# EAGLE design small_7 (EAGLE 7.7.0)
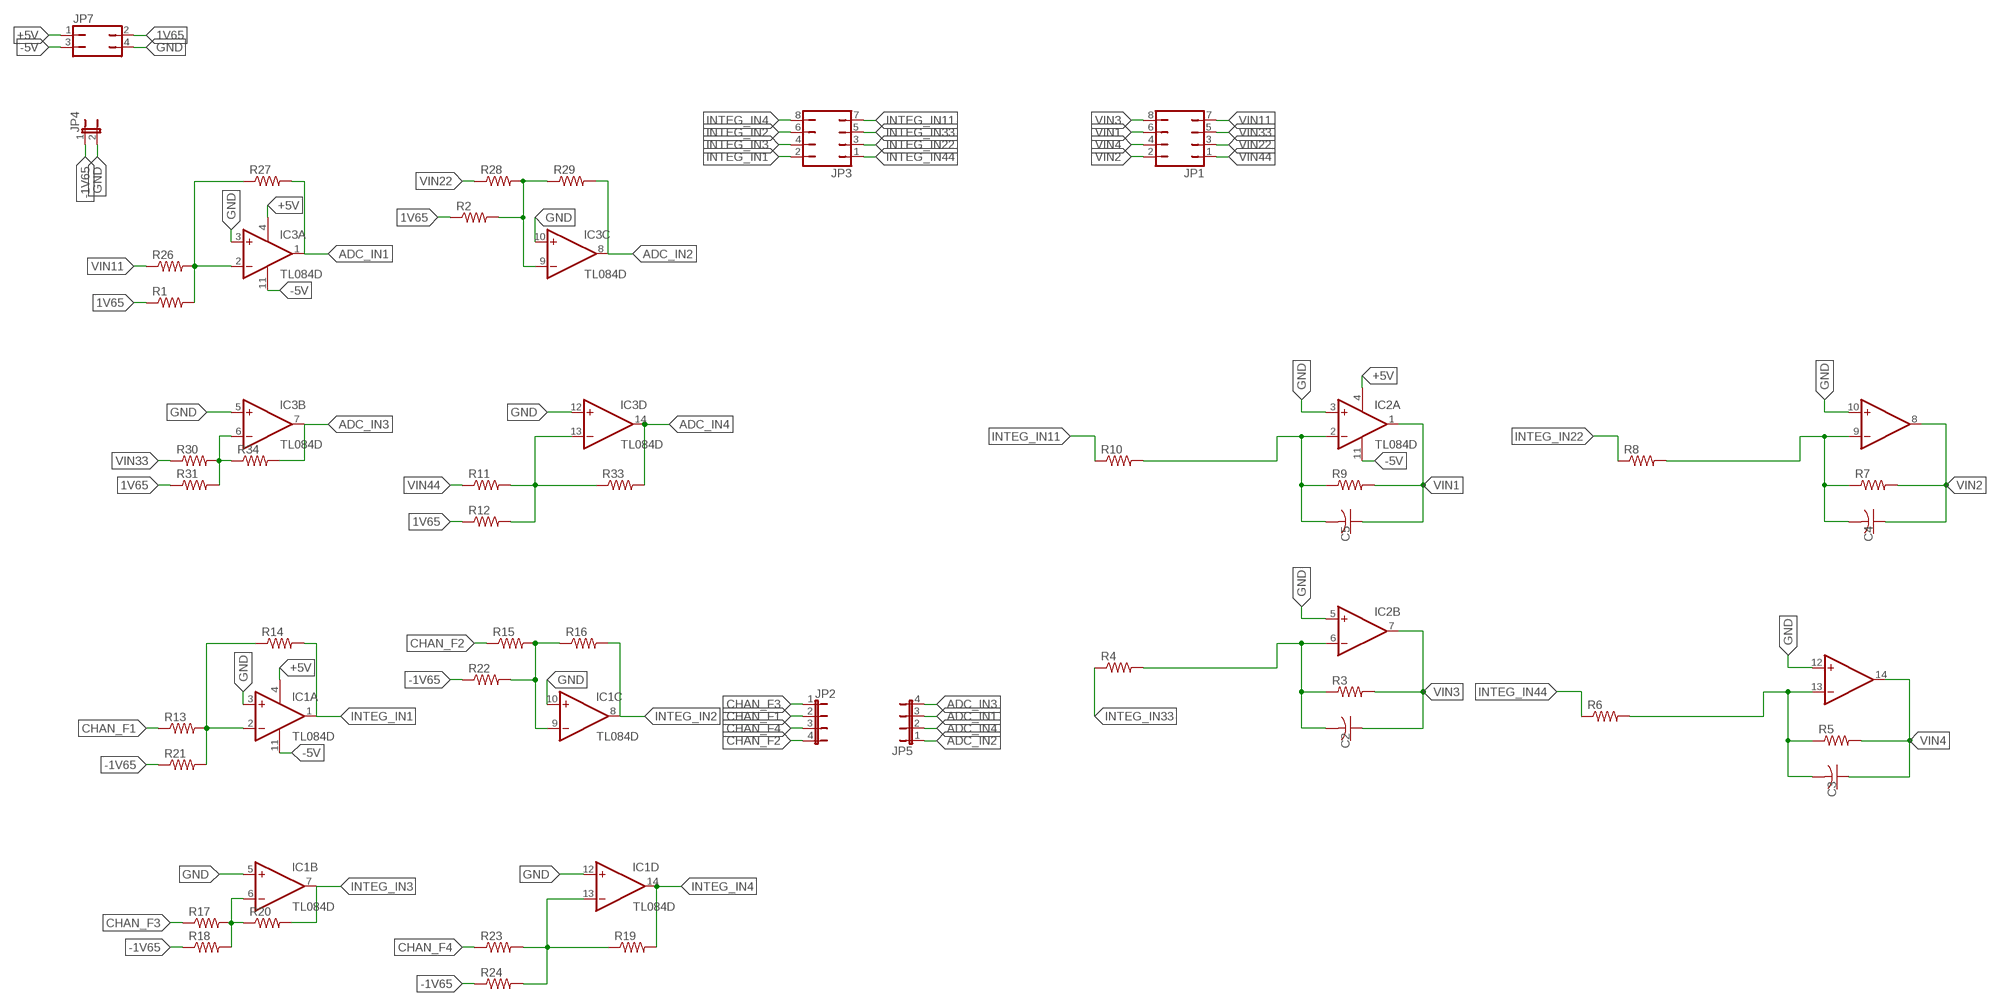
[diagram p0: schematic, sheet 1]

## Parts
C2  C-USC1206  [C1206]
C3  C-USC1206  [C1206]
C4  C-USC1206  [C1206]
C5  C-USC1206  [C1206]
IC1  TL084D  [SO14]
IC2  TL084D  [SO14]
IC3  TL084D  [SO14]
JP1  JP4Q  [JP4Q]
JP2  JP4E  [JP4]
JP3  JP4Q  [JP4Q]
JP4  JP1E  [JP1]
JP5  JP4E  [JP4]
JP7  JP2Q  [JP2Q]
R1  R-US_R1206  [R1206]
R2  R-US_R1206  [R1206]
R3  R-US_R1206  [R1206]
R4  R-US_R1206  [R1206]
R5  R-US_R1206  [R1206]
R6  R-US_R1206  [R1206]
R7  R-US_R1206  [R1206]
R8  R-US_R1206  [R1206]
R9  R-US_R1206  [R1206]
R10  R-US_R1206  [R1206]
R11  R-US_R1206  [R1206]
R12  R-US_R1206  [R1206]
R13  R-US_R1206  [R1206]
R14  R-US_R1206  [R1206]
R15  R-US_R1206  [R1206]
R16  R-US_R1206  [R1206]
R17  R-US_R1206  [R1206]
R18  R-US_R1206  [R1206]
R19  R-US_R1206  [R1206]
R20  R-US_R1206  [R1206]
R21  R-US_R1206  [R1206]
R22  R-US_R1206  [R1206]
R23  R-US_R1206  [R1206]
R24  R-US_R1206  [R1206]
R26  R-US_R1206  [R1206]
R27  R-US_R1206  [R1206]
R28  R-US_R1206  [R1206]
R29  R-US_R1206  [R1206]
R30  R-US_R1206  [R1206]
R31  R-US_R1206  [R1206]
R33  R-US_R1206  [R1206]
R34  R-US_R1206  [R1206]

## Nets
1V65: JP7.2 R1.1 R2.1 R12.1 R31.1
+5V: IC1.4(P:V+) IC2.4(P:V+) IC3.4(P:V+) JP7.1
-1V65: JP4.1 R18.1 R21.1 R22.1 R24.1
-5V: IC1.11(P:V-) IC2.11(P:V-) IC3.11(P:V-) JP7.3
ADC_IN1: IC3.1(A:OUT) JP5.3 R27.2
ADC_IN2: IC3.8(C:OUT) JP5.1 R29.2
ADC_IN3: IC3.7(B:OUT) JP5.4 R34.2
ADC_IN4: IC3.14(D:OUT) JP5.2 R33.2
CHAN_F1: JP2.2 R13.1
CHAN_F2: JP2.4 R15.1
CHAN_F3: JP2.1 R17.1
CHAN_F4: JP2.3 R23.1
GND [power]: IC1.3(A:+IN) IC1.5(B:+IN) IC1.10(C:+IN) IC1.12(D:+IN) IC2.3(A:+IN) IC2.5(B:+IN) IC2.10(C:+IN) IC2.12(D:+IN) IC3.3(A:+IN) IC3.5(B:+IN) IC3.10(C:+IN) IC3.12(D:+IN) JP4.2 JP7.4
INTEG_IN1: IC1.1(A:OUT) JP3.2 R14.2
INTEG_IN2: IC1.8(C:OUT) JP3.6 R16.2
INTEG_IN3: IC1.7(B:OUT) JP3.4 R20.2
INTEG_IN4: IC1.14(D:OUT) JP3.8 R19.2
INTEG_IN11: JP3.7 R10.1
INTEG_IN22: JP3.3 R8.1
INTEG_IN33: JP3.5 R4.1
INTEG_IN44: JP3.1 R6.1
N$1: IC1.2(A:-IN) R13.2 R14.1 R21.2
N$3: IC1.9(C:-IN) R15.2 R16.1 R22.2
N$4: C5.2 IC2.2(A:-IN) R9.1 R10.2
N$5: C2.2 IC2.6(B:-IN) R3.1 R4.2
N$6: IC1.13(D:-IN) R19.1 R23.2 R24.2
N$7: IC1.6(B:-IN) R17.2 R18.2 R20.1
N$8: C3.2 IC2.13(D:-IN) R5.1 R6.2
N$9: C4.2 IC2.9(C:-IN) R7.1 R8.2
N$36: IC3.2(A:-IN) R1.2 R26.2 R27.1
N$38: IC3.9(C:-IN) R2.2 R28.2 R29.1
N$42: IC3.13(D:-IN) R11.2 R12.2 R33.1
N$43: IC3.6(B:-IN) R30.2 R31.2 R34.1
VIN1: C5.1 IC2.1(A:OUT) JP1.6 R9.2
VIN2: C4.1 IC2.8(C:OUT) JP1.2 R7.2
VIN3: C2.1 IC2.7(B:OUT) JP1.8 R3.2
VIN4: C3.1 IC2.14(D:OUT) JP1.4 R5.2
VIN11: JP1.7 R26.1
VIN22: JP1.3 R28.1
VIN33: JP1.5 R30.1
VIN44: JP1.1 R11.1

## Library data of the parts
C2-C5 = rcl:C-US: CAPACITOR, American symbol; SPICEPREFIX: C
IC1-IC3 = linear:TL084: OP AMP
JP1 JP3 = jumper:JP4Q: JUMPER
JP2 JP5 = jumper:JP4E: JUMPER
JP4 = jumper:JP1E: JUMPER
JP7 = jumper:JP2Q: JUMPER
R1-R24 R26-R31 R33 R34 = rcl:R-US_: RESISTOR, American symbol; SPICEPREFIX: R

## Net classes
1 power: width 0.254 mm

## Board
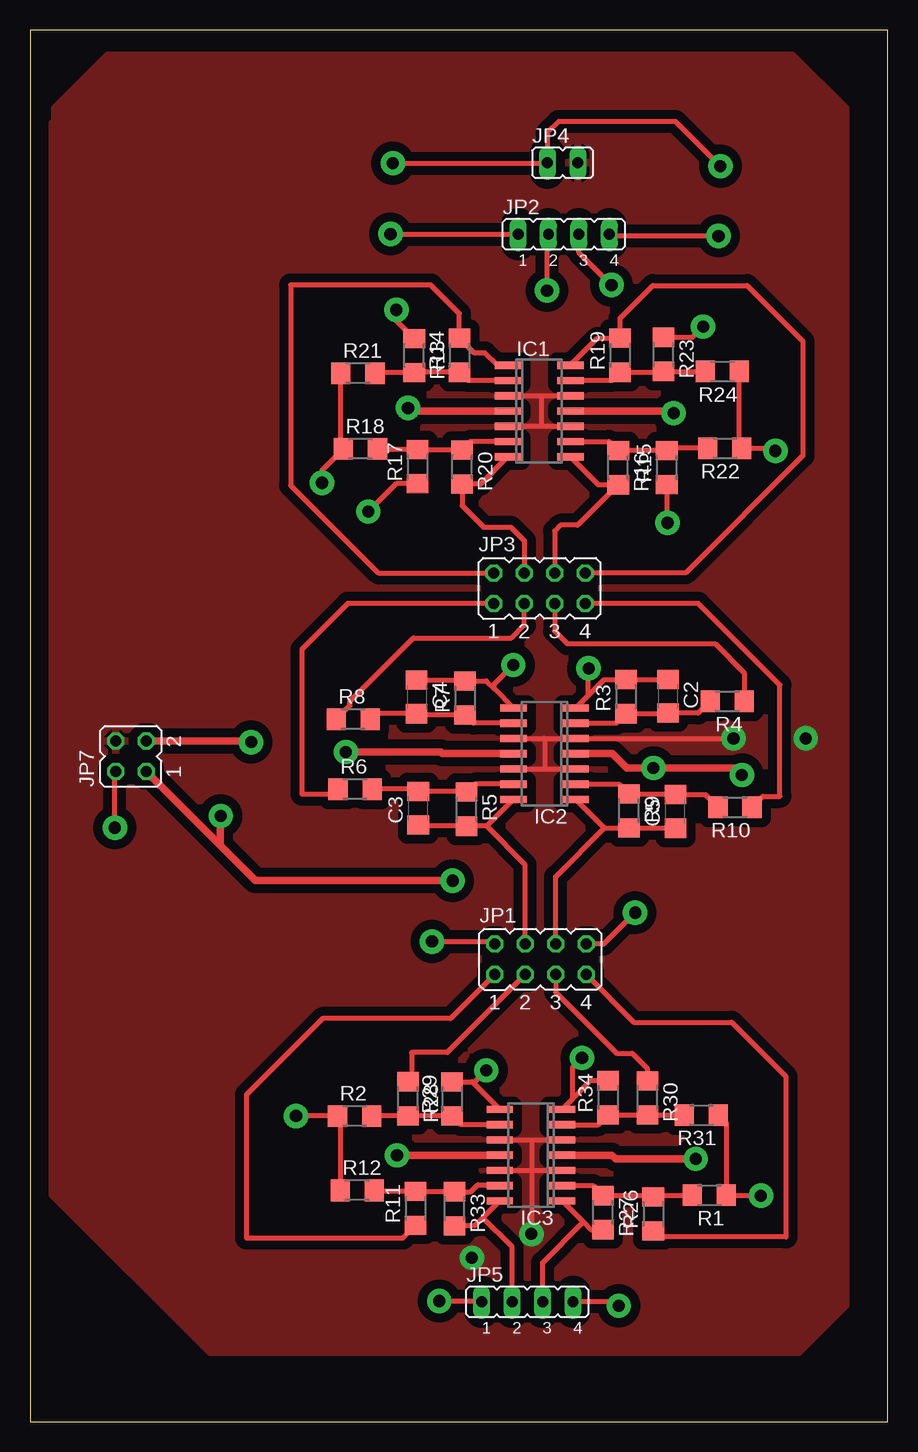
[diagram p1: board, top side]
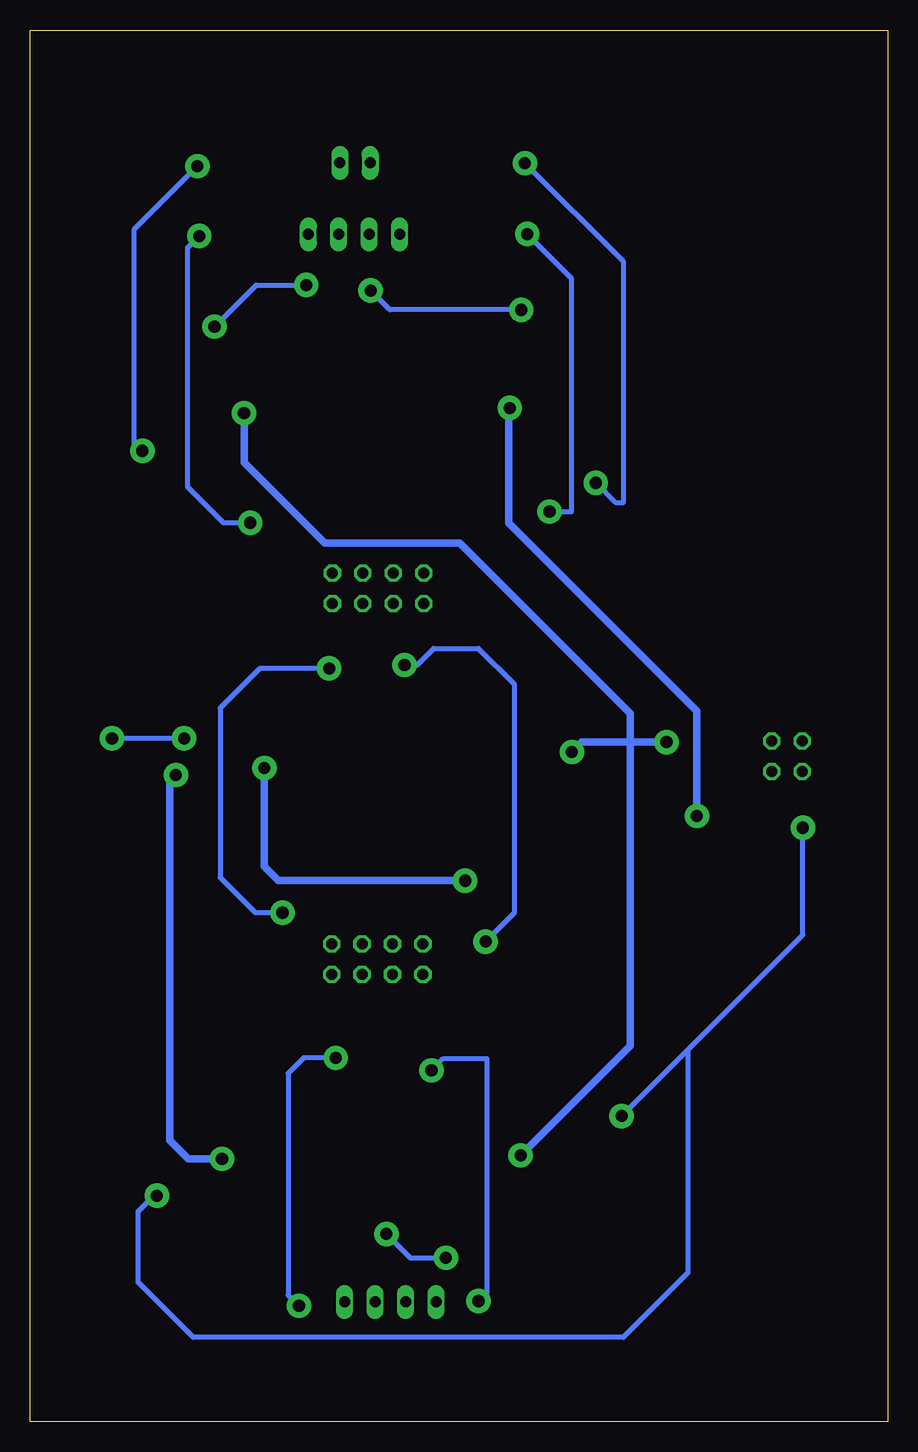
[diagram p2: board, bottom side, seen from below]

Size 71.48 x 116.03 mm. Coordinates in mm from the lower left corner, seen from the top.
Outline: 0,0 71.48,0 71.48,116.03 0,116.03 0,0
Copper layers (1*16): Top 0.035mm / dielectric 1.5mm / Bottom 0.035mm
Design rules: minimum track width 16mil, minimum drill 30mil, track to track 30mil, track to pad 30mil, pad to pad 30mil, via to via 30mil, smd to smd 30mil, copper to edge 24mil, drill to drill 24mil, minimum pad ring 10mil, minimum via ring 8mil, stop-mask expansion 4mil, vias tented up to drill 0mil, thermal gap 10mil

### Footprints (pad centres in the part's own frame; a part is rotated, then mirrored left to right if it is on the bottom)
C1206 = smd 1.6 x 1.8: 1 -1.4,0; 2 1.4,0
SO14 = smd 0.6 x 2.2: 1 -3.81,-2.6; 2 -2.54,-2.6; 3 -1.27,-2.6; 4 0,-2.6; 5 1.27,-2.6; 6 2.54,-2.6; 7 3.81,-2.6; 8 3.81,2.6; 9 2.54,2.6; 10 1.27,2.6; 11 0,2.6; 12 -1.27,2.6; 13 -2.54,2.6; 14 -3.81,2.6
JP4Q = drill 0.914 octagon: 1 -3.81,-1.27; 2 -3.81,1.27; 3 -1.27,-1.27; 4 -1.27,1.27; 5 1.27,-1.27; 6 1.27,1.27; 7 3.81,-1.27; 8 3.81,1.27
JP4 = drill 0.914 long: 1 -3.81,0; 2 -1.27,0; 3 1.27,0; 4 3.81,0
JP1 = drill 0.914 long: 1 0,-1.27; 2 0,1.27
JP2Q = drill 0.914 octagon: 1 -1.27,-1.27; 2 -1.27,1.27; 3 1.27,-1.27; 4 1.27,1.27
R1206 = smd 1.6 x 1.803: 1 -1.422,0; 2 1.422,0

### Placement (x,y rotation side)
C2  53.16,60.48 270 top
C3  32.35,51.15 90 top
C4  32.22,60.43 270 top
C5  53.78,50.89 90 top
IC1  42.43,84.26 270 top
IC2  42.88,55.7 90 top
IC3  41.74,22.24 90 top
JP1  42.54,38.55 0 top
JP2  44.48,99 0 top
JP3  42.46,69.49 0 top
JP4  44.39,104.95 270 top
JP5  41.44,10 0 top
JP7  8.4,55.48 90 top
R1  56.6,18.9 180 top
R2  27.05,25.5 0 top
R3  49.66,60.46 90 top
R4  58.1,60.08 180 top
R5  36.38,51.08 270 top
R6  27.09,52.74 0 top
R7  36.26,60.34 90 top
R8  26.94,58.58 0 top
R9  49.91,50.92 270 top
R10  58.75,51.24 180 top
R11  32.13,17.8 90 top
R12  27.27,19.3 0 top
R13  32.02,88.88 270 top
R14  35.78,88.92 90 top
R15  53.06,79.55 90 top
R16  49.02,79.54 270 top
R17  32.3,79.64 90 top
R18  27.54,81.1 0 top
R19  49.18,88.91 90 top
R20  36.01,79.59 270 top
R21  27.32,87.41 0 top
R22  57.89,81.16 180 top
R23  52.79,88.98 270 top
R24  57.69,87.55 180 top
R26  51.94,17.35 90 top
R27  47.76,17.44 270 top
R28  31.49,26.93 270 top
R29  35.18,26.93 90 top
R30  51.45,27 270 top
R31  55.94,25.58 180 top
R33  35.39,17.76 270 top
R34  48.18,27.02 90 top

### Tracks (layer width: path | path; a pad name or v marks a point on that pad's centre or on a via)
1V65  (via drill 1.02 pad 2.03)
  Top 0.406: R12.1 25.85,25.28 R2.1 v22.18,25.5 v22.17,25.49 | R31.1 58.03,24.92 R1.1 58.08,18.85 v60.9,18.85 | v7.07,49.53 7.07,54.14 JP7.2
  Bottom 0.406: v22.17,25.49 16.66,31.01 | 16.66,31.01 7.07,40.6 v7.07,49.53 | 16.66,31.01 16.66,12.4 22.04,7.03 57.86,7.03 62.46,11.63 62.46,17.56 61.17,18.85 v60.9,18.85
+5V  (via drill 1.02 pad 2.03)
  Top 0.61: JP7.1 15.84,48.04 | 15.84,48.04 18.77,45.11 v35.22,45.11 | v59.32,53.92 58.74,54.51 v51.95,54.51 49.73,54.51 48.53,55.7 IC2.4 | v55.48,21.93 48.8,21.93 48.49,22.23 IC3.4 | 15.84,48.04 15.84,50.44 v15.9,50.5 | v31.49,84.52 31.75,84.27 IC1.4
  Bottom 0.61: v35.22,45.11 50.78,45.11 51.95,46.28 v51.95,54.51 | v59.32,53.92 59.82,53.43 59.82,23.47 58.27,21.93 v55.48,21.93 | v15.9,50.5 15.9,59.24 31.58,74.92 31.58,84.43 v31.49,84.52
-1V65  (via drill 1.02 pad 2.03)
  Top 0.406: R24.1 59.11,81.37 R22.1 61.89,81.16 v62.11,80.94 | R21.1 25.9,81.32 R18.1 24.33,79.32 v24.33,78.28 | v30.24,104.93 43.1,104.93 | 43.1,104.93 JP4.1 | v57.53,104.67 53.8,108.4 44.05,108.4 43.1,107.45 43.1,104.93
  Bottom 0.406: v24.33,78.28 22.68,76.64 22,76.64 22,96.69 v30.24,104.93 | v62.11,80.94 62.77,81.6 62.77,99.42 v57.53,104.67
-5V  (via drill 1.02 pad 2.03)
  Top 0.61: JP7.3 18.35,56.75 v18.43,56.67 | v26.32,55.84 34.23,55.84 34.37,55.7 IC2.11 | IC2.11 | IC3.11 30.61,22.23 v30.59,22.21 | v53.63,84.09 53.46,84.26 45.1,84.26 IC1.11
  Bottom 0.61: v18.43,56.67 21.45,56.67 | 21.45,56.67 25.49,56.67 v26.32,55.84 | v30.59,22.21 21.45,31.36 21.45,56.67 | 21.45,56.67 21.45,59.04 35.64,73.24 46.92,73.24 53.63,79.95 v53.63,84.09
ADC_IN1
  Top 0.406: IC3.1 46.11,16.66 | 46.11,16.66 46.75,16.02 R27.2 | JP5.3 42.71,13.26 46.11,16.66
ADC_IN2  (via drill 1.02 pad 2.03)
  Top 0.406: v38.02,29.3 37.07,28.35 R29.2 36.84,28.35 IC3.8 | v34.1,10.07 37.56,10.07 JP5.1
  Bottom 0.406: v38.02,29.3 37.02,30.29 33.41,30.29 33.41,10.77 v34.1,10.07
ADC_IN3  (via drill 1.02 pad 2.03)
  Top 0.406: IC3.7 45.21,26.91 | 45.21,26.91 46.74,28.45 R34.2 | 45.21,26.91 45.21,29.55 v45.99,30.34 | v49.06,9.68 48.74,10 JP5.4
  Bottom 0.406: v45.99,30.34 48.67,30.34 49.96,29.05 49.96,10.57 v49.06,9.68
ADC_IN4
  Top 0.406: IC3.14 37.74,17.02 | 37.74,17.02 37.06,16.34 R33.2 | JP5.2 40.17,14.59 37.74,17.02
CHAN_F1  (via drill 1.02 pad 2.03)
  Top 0.406: R13.1 30.53,91.79 v30.53,92.7 | v43.09,94.31 43.09,98.88 JP2.2
  Bottom 0.406: v30.53,92.7 41.48,92.7 v43.09,94.31
CHAN_F2  (via drill 1.02 pad 2.03)
  Top 0.406: R15.1 53.06,75 v53.12,74.94 | v57.37,98.85 48.44,98.85 JP2.4
  Bottom 0.406: v53.12,74.94 55.35,74.94 58.34,77.93 58.34,97.89 v57.37,98.85
CHAN_F3  (via drill 1.02 pad 2.03)
  Top 0.406: R17.1 30.53,78.22 v28.19,75.88 | v30.04,99.02 30.06,99 JP2.1
  Bottom 0.406: v28.19,75.88 26.34,75.88 26.34,95.31 v30.04,99.02
CHAN_F4  (via drill 1.02 pad 2.03)
  Top 0.406: R23.1 55.2,90.41 v56.09,91.3 | v48.46,94.76 45.75,97.47 JP2.3
  Bottom 0.406: v56.09,91.3 52.63,94.76 v48.46,94.76
GND  (via drill 1.02 pad 2.03)
  Top 0.406: IC1.3 42.49,85.53 | 42.49,85.53 IC1.12 | IC1.5 42.6,82.99 | 42.6,82.99 IC1.10 | IC3.10 41.74,23.5 | 41.74,23.5 IC3.5 | IC3.12 41.8,20.96 | 41.8,20.96 IC3.3 | IC2.10 42.85,56.97 | 42.85,56.97 IC2.5 v58.63,56.97 | IC2.12 42.89,54.43 | 42.89,54.43 IC2.3 | 42.85,56.97 42.89,56.93 42.89,54.43 | 42.49,85.53 42.6,85.42 42.6,82.99 | 41.74,23.5 41.8,23.45 41.8,20.96 | 41.8,20.96 41.8,15.69 v41.78,15.67
  Bottom 0.406: v58.63,56.97 v64.65,56.97 | v41.78,15.67 39.78,13.67 v36.83,13.67
  pour Top: 1.87,108.24 1.87,18.94 15.02,5.79 64.06,5.79 67.97,9.7 67.97,109.49 63.52,113.94 6.49,113.94 2.05,109.49 2.05,107.36
INTEG_IN1
  Top 0.406: IC1.1 38.94,88.07 37.91,89.11 37.02,89.11 R14.2 35.78,92.39 33.42,94.76 21.72,94.76 21.72,78.06 29.02,70.76 JP3.2
INTEG_IN2
  Top 0.406: IC1.8 47.37,78.12 R16.2 45.64,74.74 44.2,74.74 43.73,74.27 JP3.6
INTEG_IN3
  Top 0.406: IC1.7 37.55,78.17 R20.2 36.01,76.36 37.8,74.57 40.07,74.57 41.19,73.46 JP3.4
INTEG_IN4
  Top 0.406: IC1.14 47.29,90.33 R19.2 49.18,92.01 51.9,94.73 59.76,94.73 64.41,90.07 64.41,80.53 54.64,70.76 JP3.8
INTEG_IN11
  Top 0.406: R10.1 61.08,52.15 62.5,52.15 62.5,61.42 55.7,68.22 JP3.7
INTEG_IN22
  Top 0.406: R8.1 26.65,59.71 26.65,60.05 31.95,65.35 40.13,65.35 41.19,66.41 JP3.3
INTEG_IN33
  Top 0.406: JP3.5 43.73,65.92 44.77,64.88 57.08,64.88 59.52,62.44 R4.1
INTEG_IN44
  Top 0.406: JP3.1 26.46,68.22 22.65,64.4 22.65,52.32 25.26,52.32 R6.1
N$1
  Top 0.406: IC1.2 36.48,86.8 R14.1 32.05,87.49 R13.2 28.8,87.46 R21.2
N$3
  Top 0.406: R22.2 53.25,81.16 R15.2 R16.1 48.26,81.72 IC1.9
N$4
  Top 0.406: R10.2 56.28,52.29 C5.2 53.73,52.34 R9.1 49.09,53.16 IC2.2
N$5
  Top 0.406: IC2.6 48.86,58.24 R3.1 53.11,59.03 C2.2 55.67,59.08 R4.2
N$6
  Top 0.406: IC1.13 48.49,86.8 R19.1 52.72,87.49 R23.2 56.26,87.56 R24.2
N$7
  Top 0.406: R18.2 31.89,81.11 | 31.89,81.11 32.26,81.11 R17.2 | 31.89,81.11 31.98,81.01 R20.1 36.72,81.72 IC1.6
N$8
  Top 0.406: IC2.13 37.04,53.16 R5.1 36.34,52.55 C3.2 32.16,52.74 R6.2
N$9
  Top 0.406: IC2.9 36.94,58.24 R7.1 32.34,58.92 C4.2 28.82,59.03 R8.2
N$36
  Top 0.406: IC3.2 46.93,19.7 R27.1 51.85,18.86 R26.2 52.08,18.9 R1.2
N$38
  Top 0.406: IC3.9 35.91,24.77 R29.1 R28.2 28.49,25.51 R2.2
N$42
  Top 0.406: IC3.13 39.06,19.78 37.33,19.78 36.74,19.19 R33.1 32.16,19.19 R11.2 28.77,19.23 R12.2
N$43
  Top 0.406: IC3.6 47.35,24.77 R34.1 51.43,25.6 R30.2 R31.2
VIN1
  Top 0.406: C5.1 R9.2 47.87,49.5 | IC2.1 47.87,49.5 | JP1.6 43.81,45.44 47.87,49.5
VIN2  (via drill 1.02 pad 2.03)
  Top 0.406: C4.1 36.19,61.83 R7.2 38.02,61.77 38.67,61.12 | 38.67,61.12 IC2.8 | 38.67,61.12 38.67,61.49 v40.27,63.09 | v33.51,40.04 38.51,40.04 JP1.2
  Bottom 0.406: v40.27,63.09 39.23,63.09 37.83,64.48 34.11,64.48 31.14,61.51 31.14,42.41 v33.51,40.04
VIN3  (via drill 1.02 pad 2.03)
  Top 0.406: IC2.7 46.52,60.55 | 46.52,60.55 47.85,61.88 R3.2 C2.1 | 46.52,60.55 46.52,63.15 46.55,63.19 v46.55,62.8 | v50.43,42.45 47.8,39.83 JP1.8
  Bottom 0.406: v46.55,62.8 52.32,62.8 55.63,59.49 55.63,45.37 52.71,42.45 v50.43,42.45
VIN4
  Top 0.406: IC2.14 38.05,49.66 | 38.05,49.66 R5.2 32.44,49.66 C3.1 | JP1.4 41.27,46.44 38.05,49.66
VIN11
  Top 0.406: JP1.7 50.32,33.31 58.46,33.31 62.99,28.79 62.99,15.42 52.44,15.42 R26.1
VIN22
  Top 0.406: JP1.3 34.77,30.79 31.81,30.79 31.81,28.68 R28.1
VIN33
  Top 0.406: JP1.5 43.81,35.8 48.88,30.73 50.19,30.73 51.45,29.46 R30.1
VIN44
  Top 0.406: JP1.1 35.05,33.61 24.38,33.61 18.02,27.26 18.02,15.32 31.07,15.32 R11.1